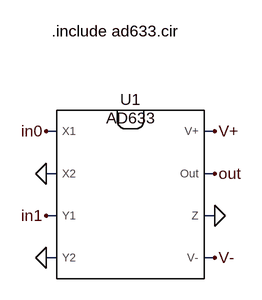
[diagram p0: schematic multiplier.asc]
multiplier.asc, the LTspice schematic file:
Version 4
SHEET 1 1792 680
WIRE 352 -128 336 -128
WIRE 592 -128 576 -128
WIRE 352 -64 336 -64
WIRE 592 -64 576 -64
WIRE 352 0 336 0
WIRE 592 0 576 0
WIRE 352 64 336 64
WIRE 592 64 576 64
FLAG 592 -128 V+
FLAG 592 64 V-
FLAG 592 0 0
FLAG 336 -64 0
FLAG 336 64 0
FLAG 336 -128 in0
FLAG 336 0 in1
FLAG 592 -64 out
SYMBOL ad633 464 -32 R0
WINDOW 3 0 -116 Center 2
SYMATTR Value AD633
SYMATTR InstName U1
TEXT 344 -280 Left 2 !.include ad633.cir

The netlist it stands for:
* multiplier.asc
XU1 in0 0 in1 0 V- 0 out V+ AD633  ; pins X1 X2 Y1 Y2 V- Z Out V+
.include ad633.cir
.backanno
.end